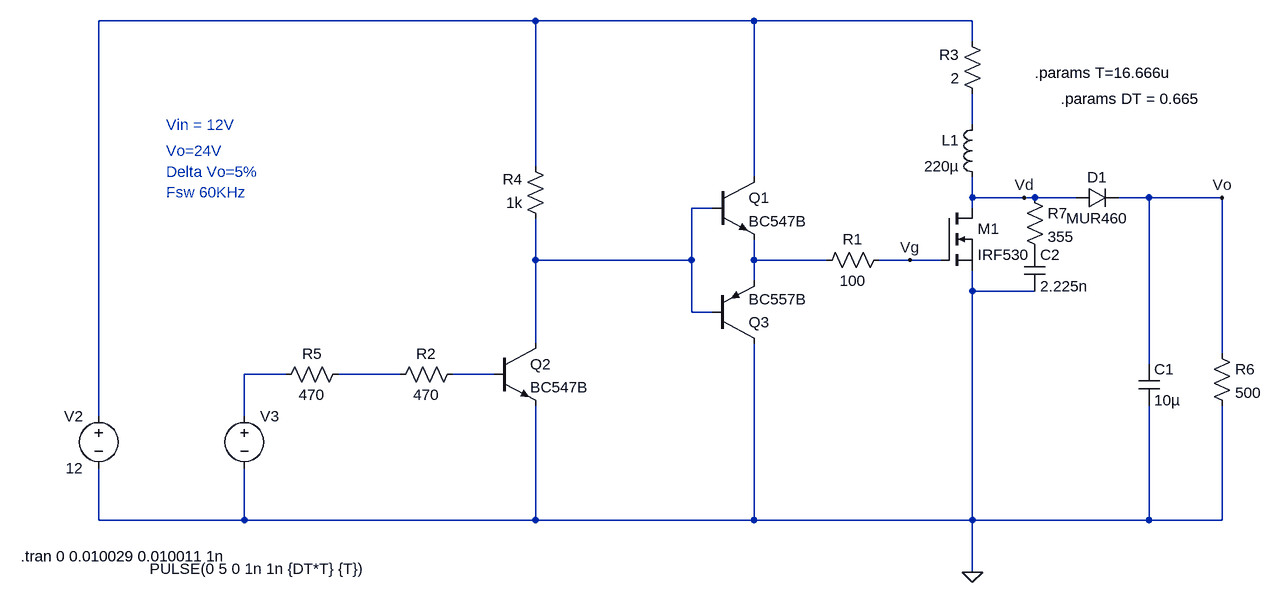
[diagram p0: schematic Draft4_snubber.asc]
Draft4_snubber.asc, the LTspice schematic file:
Version 4
SHEET 1 1280 680
WIRE -80 -272 -752 -272
WIRE 256 -272 -80 -272
WIRE 592 -272 256 -272
WIRE 592 -240 592 -272
WIRE 592 -112 592 -160
WIRE -80 -48 -80 -272
WIRE 256 -32 256 -272
WIRE 592 0 592 -32
WIRE 672 0 592 0
WIRE 688 0 672 0
WIRE 752 0 688 0
WIRE 864 0 816 0
WIRE 976 0 864 0
WIRE 192 16 160 16
WIRE 592 16 592 0
WIRE -80 96 -80 32
WIRE 160 96 160 16
WIRE 160 96 -80 96
WIRE 256 96 256 64
WIRE 368 96 256 96
WIRE 496 96 448 96
WIRE 544 96 496 96
WIRE 256 128 256 96
WIRE 592 144 592 112
WIRE 688 144 592 144
WIRE 160 176 160 96
WIRE 192 176 160 176
WIRE -80 224 -80 96
WIRE 976 240 976 0
WIRE 864 256 864 0
WIRE -464 272 -528 272
WIRE -288 272 -384 272
WIRE -144 272 -208 272
WIRE -752 336 -752 -272
WIRE -528 336 -528 272
WIRE -752 496 -752 416
WIRE -528 496 -528 416
WIRE -528 496 -752 496
WIRE -80 496 -80 320
WIRE -80 496 -528 496
WIRE 256 496 256 224
WIRE 256 496 -80 496
WIRE 592 496 592 144
WIRE 592 496 256 496
WIRE 864 496 864 320
WIRE 864 496 592 496
WIRE 976 496 976 320
WIRE 976 496 864 496
WIRE 592 576 592 496
FLAG 592 576 0
FLAG 496 96 Vg
FLAG 672 0 Vd
FLAG 976 0 Vo
SYMBOL npn 192 -32 R0
SYMATTR InstName Q1
SYMATTR Value BC547B
SYMBOL npn -144 224 R0
SYMATTR InstName Q2
SYMATTR Value BC547B
SYMBOL pnp 192 224 M180
SYMATTR InstName Q3
SYMATTR Value BC557B
SYMBOL nmos 544 16 R0
SYMATTR InstName M1
SYMATTR Value IRF530
SYMBOL diode 752 16 R270
WINDOW 0 32 32 VTop 2
WINDOW 3 0 32 VBottom 2
SYMATTR InstName D1
SYMATTR Value MUR460
SYMBOL res 464 80 R90
WINDOW 0 0 56 VBottom 2
WINDOW 3 32 56 VTop 2
SYMATTR InstName R1
SYMATTR Value 100
SYMBOL res -192 256 R90
WINDOW 0 0 56 VBottom 2
WINDOW 3 32 56 VTop 2
SYMATTR InstName R2
SYMATTR Value 470
SYMBOL res 608 -144 R180
WINDOW 0 36 76 Left 2
WINDOW 3 36 40 Left 2
SYMATTR InstName R3
SYMATTR Value 2
SYMBOL res -64 48 R180
WINDOW 0 36 76 Left 2
WINDOW 3 36 40 Left 2
SYMATTR InstName R4
SYMATTR Value 1k
SYMBOL res -480 288 R270
WINDOW 0 32 56 VTop 2
WINDOW 3 0 56 VBottom 2
SYMATTR InstName R5
SYMATTR Value 470
SYMBOL ind 608 -128 M0
SYMATTR InstName L1
SYMATTR Value 220µ
SYMBOL voltage -752 320 M0
WINDOW 123 0 0 Left 0
WINDOW 39 0 0 Left 0
SYMATTR InstName V2
SYMATTR Value 12
SYMBOL cap 848 256 R0
SYMATTR InstName C1
SYMATTR Value 10µ
SYMBOL res 960 224 R0
SYMATTR InstName R6
SYMATTR Value 500
SYMBOL voltage -528 320 R0
WINDOW 3 -146 251 Left 2
WINDOW 123 0 0 Left 0
WINDOW 39 0 0 Left 0
SYMATTR Value PULSE(0 5 0 1n 1n {DT*T} {T})
SYMATTR InstName V3
SYMBOL res 672 -16 R0
SYMATTR InstName R7
SYMATTR Value 355
SYMBOL cap 672 80 R0
SYMATTR InstName C2
SYMATTR Value 2.225n
TEXT -872 552 Left 2 !.tran 0 0.010029 0.010011 1n
TEXT -648 -112 Left 2 ;Vin = 12V
TEXT -648 -72 Left 2 ;Vo=24V
TEXT -648 -40 Left 2 ;Delta Vo=5%
TEXT -648 -8 Left 2 ;Fsw 60KHz
TEXT 728 -152 Left 2 !.params DT = 0.665
TEXT 688 -192 Left 2 !.params T=16.666u

The netlist it stands for:
* Draft4_snubber.asc
Q1 N001 N003 N004 0 BC547B
Q2 N003 N007 0 0 BC547B
Q3 0 N003 N004 0 BC557B
M1 Vd Vg 0 0 IRF530
D1 Vd Vo MUR460
R1 Vg N004 100
R2 N007 N006 470
R3 N002 N001 2
R4 N003 N001 1k
R5 N005 N006 470
L1 N002 Vd 220µ
V2 N001 0 12
C1 Vo 0 10µ
R6 Vo 0 500
V3 N005 0 PULSE(0 5 0 1n 1n {DT*T} {T})
R7 Vd P001 355
C2 P001 0 2.225n
.model D D
.lib standard.dio
.model NPN NPN
.model PNP PNP
.lib standard.bjt
.model NMOS NMOS
.model PMOS PMOS
.lib standard.mos
.tran 0 0.010029 0.010011 1n
* Vin = 12V
* Vo=24V
* Delta Vo=5%
* Fsw 60KHz
.params DT = 0.665
.params T=16.666u
.backanno
.end

* Results of the author's LTspice run, read from the files saved beside the schematic
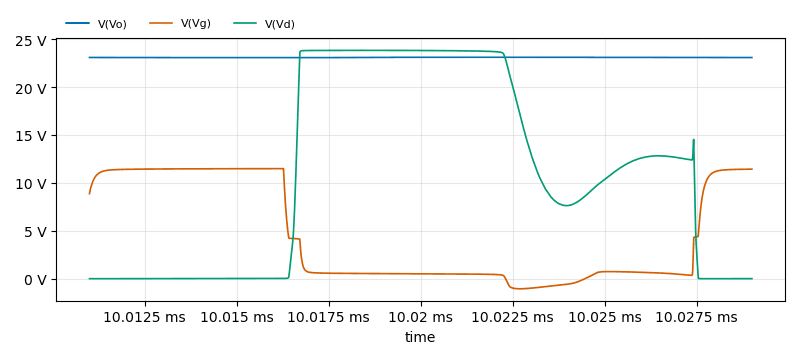
[diagram p1: Transient Analysis of Draft4_snubber.asc, plotted from the saved traces]
* Transient Analysis, 1 run:
*   V(Vo): min 23.06 V, max 23.12 V, average 23.09 V, rms 23.09 V, last 23.08 V
*   V(Vg): min -1.051 V, max 11.49 V, average 4.554 V, rms 6.982 V, last 11.44 V
*   V(Vd): min 4.027 mV, max 23.83 V, average 10.92 V, rms 14.85 V, last 7.753 mV